# EAGLE schematic scheme (EAGLE 6.6.0)
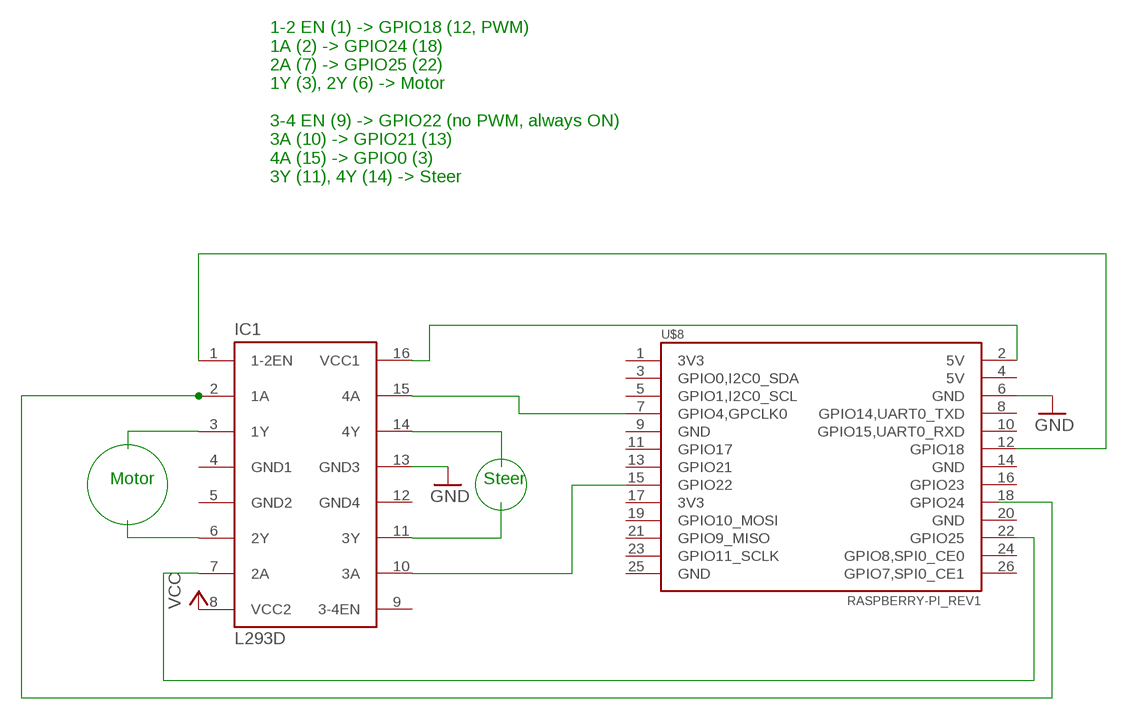
[diagram p0: schematic, sheet 1]

## Parts
IC1  L293D  [DIL16]
U$8  RASPBERRY-PI_REV1  [RASPBERRY-PI_REV1]

## Nets
GND: IC1.13(GND3) U$8.6(GND)
N$1: IC1.1(1-2EN) U$8.12(GPIO18)
N$2: IC1.2(1A)
N$3: IC1.7(2A) U$8.22(GPIO25)
N$4: IC1.16(VCC1) U$8.2(5V)
N$5: IC1.15(4A) U$8.7(GPIO4,GPCLK0)
N$7: IC1.3(1Y)
N$8: IC1.6(2Y)
N$9: IC1.11(3Y)
N$10: IC1.14(4Y)
N$12: IC1.10(3A) U$8.15(GPIO22)
VCC: IC1.8(VCC2)
Unconnected: IC1.9(3-4EN) U$8.1(3V3) U$8.3(GPIO0,I2C0_SDA) U$8.4(5V) U$8.5(GPIO1,I2C0_SCL) U$8.8(GPIO14,UART0_TXD) U$8.9(GND) U$8.10(GPIO15,UART0_RXD) U$8.11(GPIO17) U$8.13(GPIO21) U$8.14(GND) U$8.16(GPIO23) U$8.17(3V3) U$8.18(GPIO24) U$8.19(GPIO10_MOSI) U$8.20(GND) U$8.21(GPIO9_MISO) U$8.23(GPIO11_SCLK) U$8.24(GPIO8,SPI0_CE0) U$8.25(GND) U$8.26(GPIO7,SPI0_CE1)

## Notes on the sheet
- 1-2 EN (1) -> GPIO18 (12, PWM)
  1A (2) -> GPIO24 (18)
  2A (7) -> GPIO25 (22)
  1Y (3), 2Y (6) -> Motor
  
  3-4 EN (9) -> GPIO22 (no PWM, always ON)
  3A (10) -> GPIO21 (13)
  4A (15) -> GPIO0 (3)
  3Y (11), 4Y (14) -> Steer
- Motor | Steer

## Power pins joined to a net without a drawn wire
GND1: IC1.4(GND1)
GND2: IC1.5(GND2)
GND4: IC1.12(GND4)

## Library data of the parts
IC1 = st-microelectronics:L293D: PUSH-PULL 4 CHANNEL DRIVER; MF: TEXAS INSTRUMENTS; MPN: L293DNEE4; OC_FARNELL: 9589619; OC_NEWARK: 56P8249
U$8 = RaspberryPi:RASPBERRY-PI_REV1: Raspberry Pi Board <http://www.raspberrypi.org/> Jacques Lagnel V1.0 (beta) 2012 Mateusz Bawaj V1.1 (beta) 2012 Board dimension: Forum 3D model <http://www.raspberrypi.org/forum/general-discussion/mechanical-profile-3d-models?value=3d%20model&type=1&include=1&search=1&ret=all> The GPIO Connector (P1): http://elinux.org/RPi_Low-level_peripherals; OC_FARNELL: unknown